# EAGLE schematic main_board (EAGLE 6.6.0)
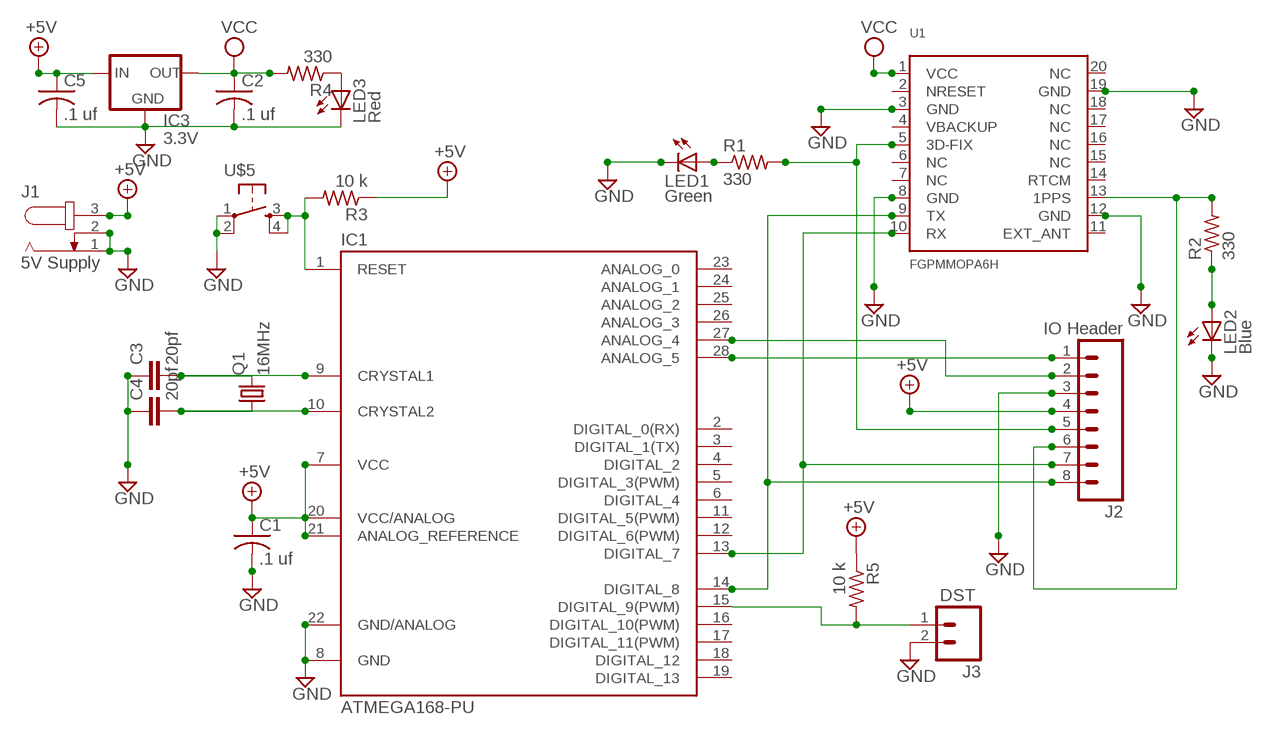
[diagram p0: schematic, sheet 1]

## Parts
C1  .1 uf  C-US025-025X050  [C025-025X050]
C2  .1 uf  C-US025-025X050  [C025-025X050]
C3  20pf  C-EU025-024X044  [C025-024X044]
C4  20pf  C-EU025-024X044  [C025-024X044]
C5  .1 uf  C-US025-025X050  [C025-025X050]
IC1  ATMEGA168-PU  [DIL28-3]
IC3  3.3V  MCP1700TRI  [TO92]
J1  5V Supply  JACK-PLUG1  [SPC4078]
J2  IO Header  M08  [1X08_ROUND]
J3  DST  M02LOCK  [1X02_LOCK]
LED1  Green  LED3MM  [LED3MM]
LED2  Blue  LED3MM  [LED3MM]
LED3  Red  LED3MM  [LED3MM]
Q1  16MHz  CRYSTALHC18U-V  [HC18U-V]
R1  330  R-US_0204/5  [0204/5]
R2  330  R-US_0204/5  [0204/5]
R3  10 k  R-US_0204/5  [0204/5]
R4  330  R-US_0204/5  [0204/5]
R5  10 k  R-US_0204/5  [0204/5]
U1  FGPMMOPA6H  GPS_FGPMMOPA6H  [FGPMMOPA6H]
U$5  TACTILE-SWITCH-PTH  [TAC-SWITCH-PTH]

## Nets
+5V: C1.1 C5.1 IC1.7(VCC) IC1.20(VCC/ANALOG) IC1.21(ANALOG_REFERENCE) IC3.2(IN) J1.3 J2.4 R3.1 R5.1
DST: IC1.15(DIGITAL_9(PWM)) J3.1 R5.2
GND: C1.2 C2.2 C3.1 C4.1 C5.2 IC1.8(GND) IC1.22(GND/ANALOG) IC3.1(GND) J1.1 J1.2 J2.3 J3.2 LED1.K(C) LED2.K(C) LED3.K(C) U1.3(GND) U1.8(GND) U1.12(GND) U1.19(GND) U$5.1 U$5.2
N$1: C4.2 IC1.10(CRYSTAL2) Q1.1
N$2: C3.2 IC1.9(CRYSTAL1) Q1.2
N$3: IC1.13(DIGITAL_7) J2.7 U1.10(RX)
N$4: IC1.14(DIGITAL_8) J2.8 U1.9(TX)
N$5: LED3.A R4.1
N$6: IC1.28(ANALOG_5) J2.1
N$7: IC1.1(RESET) R3.2 U$5.3 U$5.4
N$8: IC1.27(ANALOG_4) J2.2
N$9: J2.6 R2.2 U1.13(1PPS)
N$10: J2.5 R1.2 U1.5(3D-FIX)
N$15: LED1.A R1.1
N$16: LED2.A R2.1
VCC: C2.1 IC3.3(OUT) R4.2 U1.1(VCC)
Unconnected: IC1.2(DIGITAL_0(RX)) IC1.3(DIGITAL_1(TX)) IC1.4(DIGITAL_2) IC1.5(DIGITAL_3(PWM)) IC1.6(DIGITAL_4) IC1.11(DIGITAL_5(PWM)) IC1.12(DIGITAL_6(PWM)) IC1.16(DIGITAL_10(PWM)) IC1.17(DIGITAL_11(PWM)) IC1.18(DIGITAL_12) IC1.19(DIGITAL_13) IC1.23(ANALOG_0) IC1.24(ANALOG_1) IC1.25(ANALOG_2) IC1.26(ANALOG_3) U1.2(NRESET) U1.4(VBACKUP) U1.6(NC) U1.7(NC) U1.11(EXT_ANT) U1.14(RTCM) U1.15(NC) U1.16(NC) U1.17(NC) U1.18(NC) U1.20(NC)

## Library data of the parts
C1 C2 C5 = rcl:C-US: CAPACITOR, American symbol
C3 C4 = resistor:C-EU: CAPACITOR, European symbol
IC1 = Arduino-AVR:ATMEGA168-PU
IC3 = adafruit:MCP1700: VOLTAGE REGULATOR
J1 = con-jack:JACK-PLUG: DC POWER JACK Power Jack, DC, Right Angle, Through Hole, Rated 5A at 16VDC, PC Terminals Distributor: Farnell (www.Farnell.de) Drawing: 84N1161.pdf / 84N1162.pdf Manufacturer: SPC Technology (www.spctechnology.com) Type: SPC4077 / SPC 4078; OC_FARNELL: unknown; OC_NEWARK: unknown
J2 = SparkFun-Connectors:M08: Header 8 Standard 8-pin 0.1" header. Use with straight break away headers (SKU : PRT-00116), right angle break away headers (PRT-00553), swiss pins (PRT-00743), machine pins (PRT-00117), and female headers (PRT-00115).; PROD_ID: CONN-08437
J3 = SparkFun-Connectors:M02: Standard 2-pin 0.1" header. Use with - straight break away headers ( PRT-00116) - right angle break away headers (PRT-00553) - swiss pins (PRT-00743) - machine pins (PRT-00117) - female headers (PRT-00115) Molex polarized connector foot print use with: PRT-08233 with associated crimp pins and housings. 2.54_SCREWTERM for use with PRT-10571. 3.5mm Screw Terminal footprints for PRT-08084 5mm Screw Terminal footprints for use with PRT-08432
LED1-LED3 = adafruit:LED: LED OSRAM: - CHIPLED LG R971, LG N971, LY N971, LG Q971, LY Q971, LO R971, LY R971 LH N974, LH R974 LS Q976, LO Q976, LY Q976 LO Q996 - Hyper CHIPLED LW Q18S LB Q993, LB Q99A, LB R99A - SideLED LS A670, LO A670, LY A670, LG A670, LP A670 LB A673, LV A673, LT A673, LW A673 LH A674 LY A675 LS A676, LA A676, LO A676, LY A676, LW A676 LS A679, LY A679, LG A679 - Hyper Micro SIDELED® LS Y876, LA Y876, LO Y876, LY Y876 LT Y87S - SmartLED LW L88C, LW L88S LB L89C, LB L89S, LG L890 LS L89K, LO L89K, LY L89K LS L896, LA L896, LO L896, LY L896 - TOPLED LS T670, LO T670, LY T670, LG T670, LP T670 LSG T670, LSP T670, LSY T670, LOP T670, LYG T670 LG T671, LOG T671, LSG T671 LB T673, LV T673, LT T673, LW T673 LH T674 LS T676, LA T676, LO T676, LY T676, LB T676, LH T676, LSB T676, LW T676 LB T67C, LV T67C, LT T67C, LS T67K, LO T67K, LY T67K, LW E67C LS E67B, LA E67B, LO E67B, LY E67B, LB E67C, LV E67C, LT E67C LW T67C LS T679, LY T679, LG T679 LS T770, LO T770, LY T770, LG T770, LP T770 LB T773, LV T773, LT T773, LW T773 LH T774 LS E675, LA E675, LY E675, LS T675 LS T776, LA T776, LO T776, LY T776, LB T776 LHGB T686 LT T68C, LB T68C - Hyper Mini TOPLED® LB M676 - Mini TOPLED Santana® LG M470 LS M47K, LO M47K, LY M47K Source: http://www.osram.convergy.de/
Q1 = adafruit:CRYSTAL: CRYSTAL; OC_FARNELL: unknown; OC_NEWARK: unknown
R1-R5 = adafruit:R-US_: RESISTOR, American symbol
U1 = Simplex-ICs:GPS_FGPMMOPA6H: GPS Module - MTK MT3339 Chipset, -165dBm sensitivity, 22 channels, 10Hz, auto-select external antenna options
U$5 = GeekAmmo:TACTILE-SWITCH: Tactile Switch 4 Pins, SPST NO